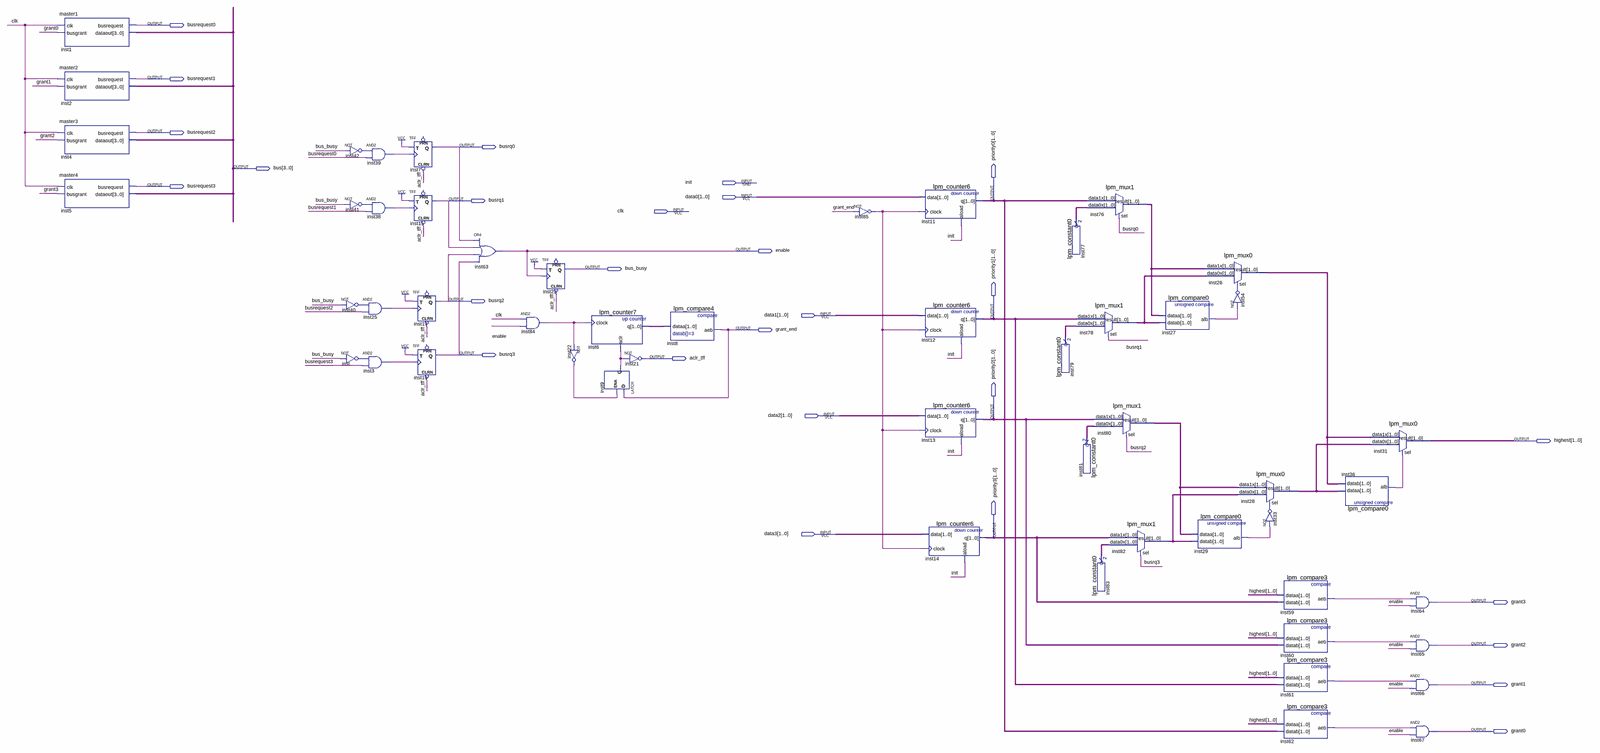
[diagram p0: schematic sheet, whole]
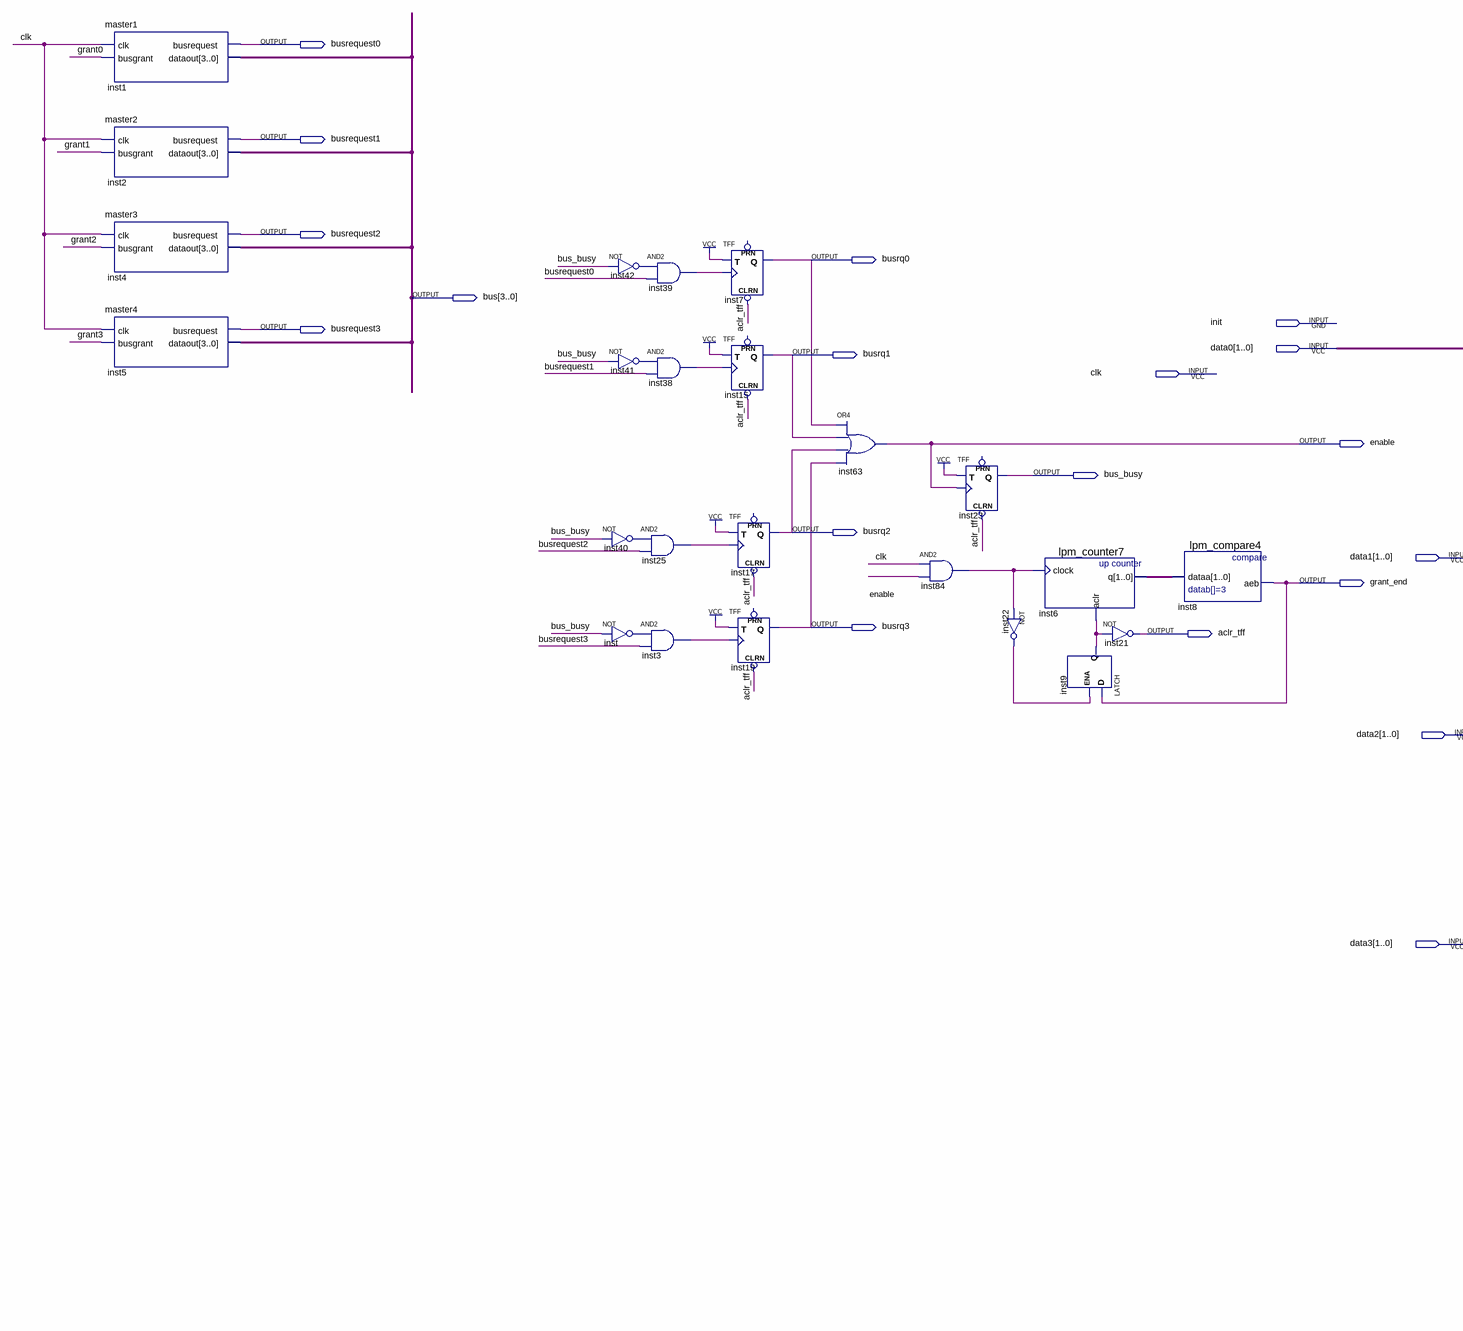
[diagram p1: schematic sheet, left part]
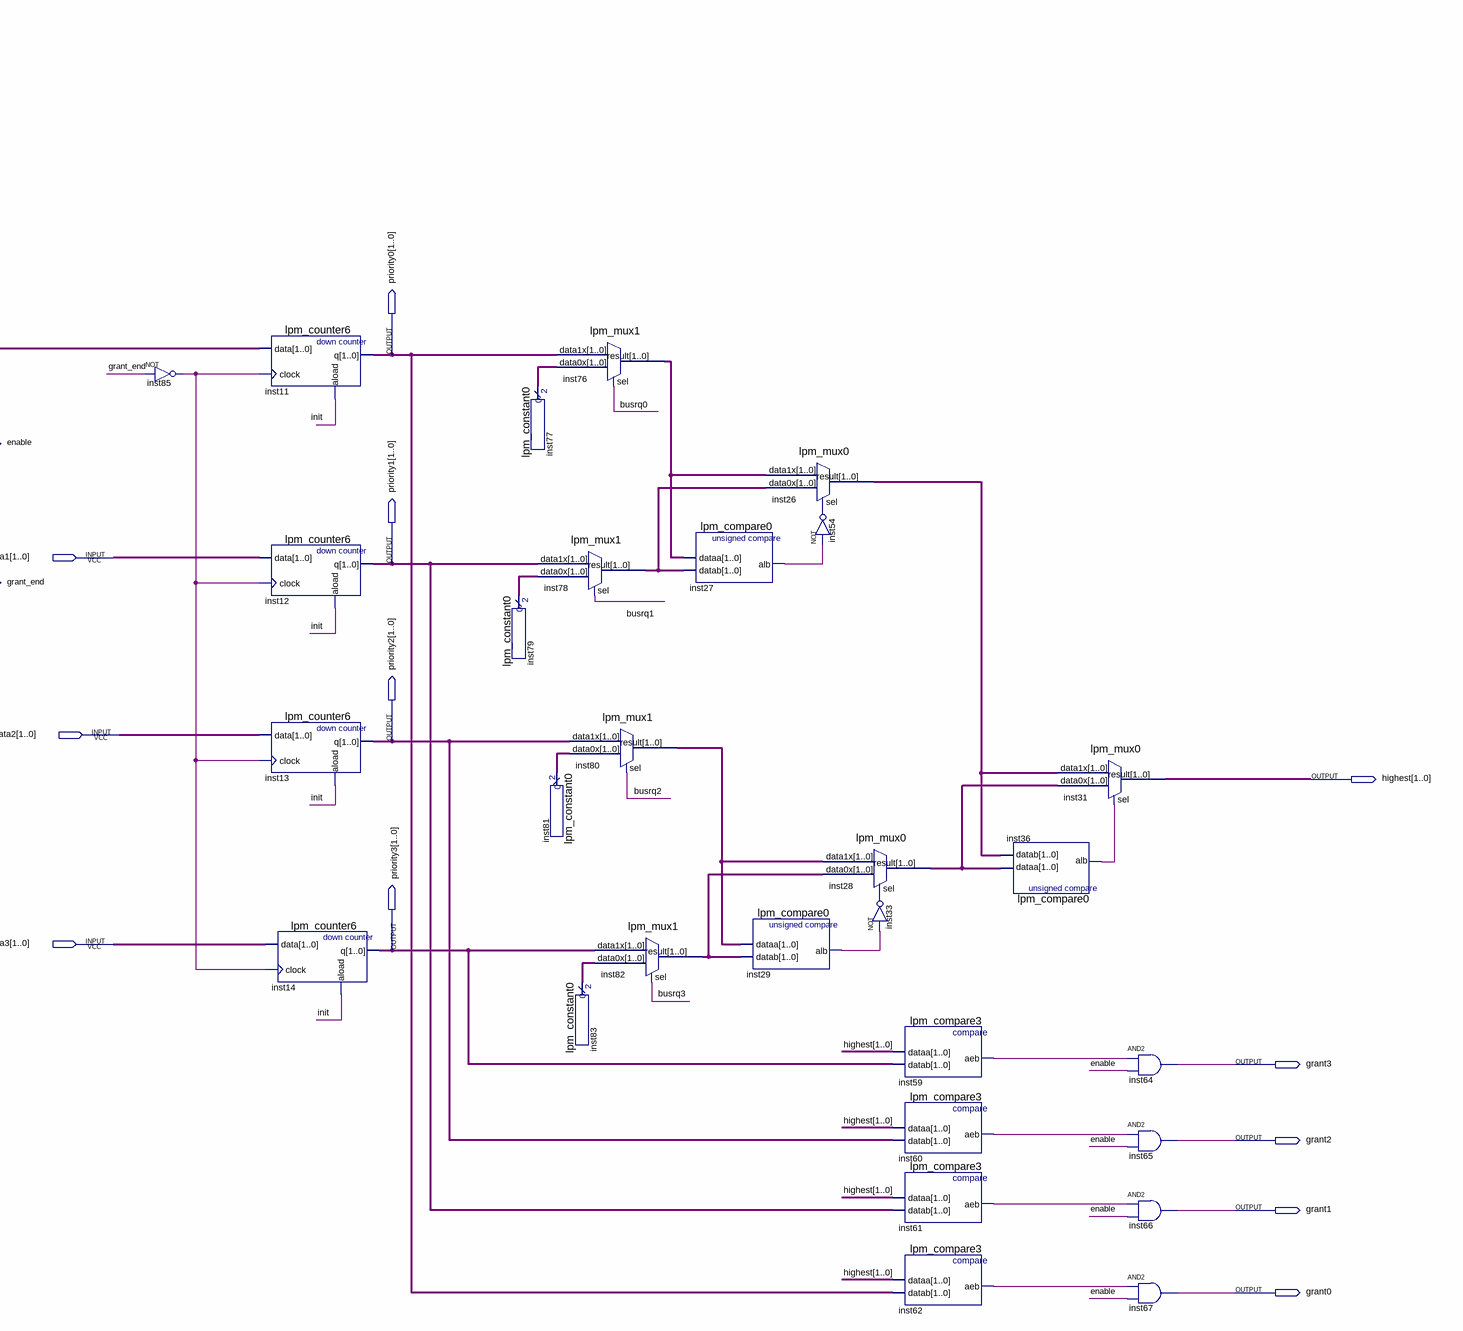
[diagram p2: schematic sheet, right part]
// Quartus schematic arbitr.bdf as structural Verilog: 53 symbols, 28 pins
module arbitr (
  input  init,
  input  [1:0] data0,
  input  clk,
  input  [1:0] data1,
  input  [1:0] data2,
  input  [1:0] data3,
  output busrequest0,
  output busrequest1,
  output busrequest2,
  output busrq0,
  output [3:0] bus,
  output busrequest3,
  output busrq1,
  output [1:0] priority0,
  output enable,
  output bus_busy,
  output busrq2,
  output [1:0] priority1,
  output grant_end,
  output busrq3,
  output aclr_tff,
  output [1:0] priority2,
  output [1:0] highest,
  output [1:0] priority3,
  output grant3,
  output grant2,
  output grant1,
  output grant0
);

  wire inst3_out, inst9_q, inst22_out, inst25_out, inst27_alb, inst29_alb, inst33_out, inst36_alb,
       inst38_out, inst39_out, inst40_out, inst41_out, inst42_out, inst54_out, inst59_aeb, inst60_aeb,
       inst61_aeb, inst62_aeb, inst84_out, inst85_out, inst_out;
  wire [1:0] inst6_q, inst26_result, inst28_result, inst76_result, inst77_result, inst78_result,
       inst79_result, inst80_result, inst81_result, inst82_result, inst83_result;

  master1 inst1 (.clk(clk), .busgrant(grant0), .busrequest(busrequest0), .dataout(bus));
  master2 inst2 (.clk(clk), .busgrant(grant1), .busrequest(busrequest1), .dataout(bus));
  master3 inst4 (.clk(clk), .busgrant(grant2), .busrequest(busrequest2), .dataout(bus));
  master4 inst5 (.clk(clk), .busgrant(grant3), .busrequest(busrequest3), .dataout(bus));
  not inst42 (inst42_out, bus_busy);
  not inst41 (inst41_out, bus_busy);
  not inst40 (inst40_out, bus_busy);
  not inst (inst_out, bus_busy);
  and inst39 (inst39_out, inst42_out, busrequest0);
  and inst38 (inst38_out, inst41_out, busrequest1);
  and inst25 (inst25_out, inst40_out, busrequest2);
  and inst3 (inst3_out, inst_out, busrequest3);
  TFF inst7 (.CLRN(aclr_tff), .T(1'b1), .CLK(inst39_out), .Q(busrq0));  // open: PRN
  TFF inst15 (.CLRN(aclr_tff), .T(1'b1), .CLK(inst38_out), .Q(busrq1));  // open: PRN
  TFF inst17 (.CLRN(aclr_tff), .T(1'b1), .CLK(inst25_out), .Q(busrq2));  // open: PRN
  TFF inst19 (.CLRN(aclr_tff), .T(1'b1), .CLK(inst3_out), .Q(busrq3));  // open: PRN
  or inst63 (enable, busrq0, busrq1, busrq2, busrq3);
  and inst84 (inst84_out, clk, enable);
  TFF inst23 (.CLRN(aclr_tff), .T(1'b1), .CLK(enable), .Q(bus_busy));  // open: PRN
  not inst22 (inst22_out, inst84_out);
  lpm_counter7 inst6 (.clock(inst84_out), .aclr(inst9_q), .q(inst6_q));
  LATCH inst9 (.D(grant_end), .ENA(inst22_out), .Q(inst9_q));
  not inst21 (aclr_tff, inst9_q);
  lpm_compare4 inst8 (.dataa(inst6_q), .aeb(grant_end));
  not inst85 (inst85_out, grant_end);
  lpm_counter6 inst11 (.data(data0), .clock(inst85_out), .aload(init), .q(priority0));
  lpm_counter6 inst12 (.data(data1), .clock(inst85_out), .aload(init), .q(priority1));
  lpm_counter6 inst13 (.data(data2), .clock(inst85_out), .aload(init), .q(priority2));
  lpm_counter6 inst14 (.data(data3), .clock(inst85_out), .aload(init), .q(priority3));
  lpm_constant0 inst77 (.result(inst77_result));
  lpm_constant0 inst79 (.result(inst79_result));
  lpm_mux1 inst76 (.data1x(priority0), .data0x(inst77_result), .sel(busrq0), .result(inst76_result));
  lpm_mux1 inst78 (.data1x(priority1), .data0x(inst79_result), .sel(busrq1), .result(inst78_result));
  lpm_mux1 inst80 (.data1x(priority2), .data0x(inst81_result), .sel(busrq2), .result(inst80_result));
  lpm_constant0 inst81 (.result(inst81_result));
  lpm_constant0 inst83 (.result(inst83_result));
  lpm_mux1 inst82 (.data1x(priority3), .data0x(inst83_result), .sel(busrq3), .result(inst82_result));
  lpm_compare0 inst27 (.dataa(inst76_result), .datab(inst78_result), .alb(inst27_alb));
  lpm_mux0 inst26 (.data1x(inst76_result), .data0x(inst78_result), .sel(inst54_out), .result(inst26_result));
  lpm_compare0 inst29 (.dataa(inst80_result), .datab(inst82_result), .alb(inst29_alb));
  not inst54 (inst54_out, inst27_alb);
  lpm_mux0 inst28 (.data1x(inst80_result), .data0x(inst82_result), .sel(inst33_out), .result(inst28_result));
  not inst33 (inst33_out, inst29_alb);
  lpm_compare3 inst59 (.dataa(highest), .datab(priority3), .aeb(inst59_aeb));
  lpm_compare3 inst60 (.dataa(highest), .datab(priority2), .aeb(inst60_aeb));
  lpm_compare3 inst61 (.dataa(highest), .datab(priority1), .aeb(inst61_aeb));
  lpm_compare3 inst62 (.dataa(highest), .datab(priority0), .aeb(inst62_aeb));
  lpm_compare0 inst36 (.dataa(inst28_result), .datab(inst26_result), .alb(inst36_alb));
  lpm_mux0 inst31 (.data1x(inst26_result), .data0x(inst28_result), .sel(inst36_alb), .result(highest));
  and inst64 (grant3, inst59_aeb, enable);
  and inst65 (grant2, inst60_aeb, enable);
  and inst66 (grant1, inst61_aeb, enable);
  and inst67 (grant0, inst62_aeb, enable);
endmodule
